# Altium schematic sheet 09.SchDoc
size 297 x 209 mm
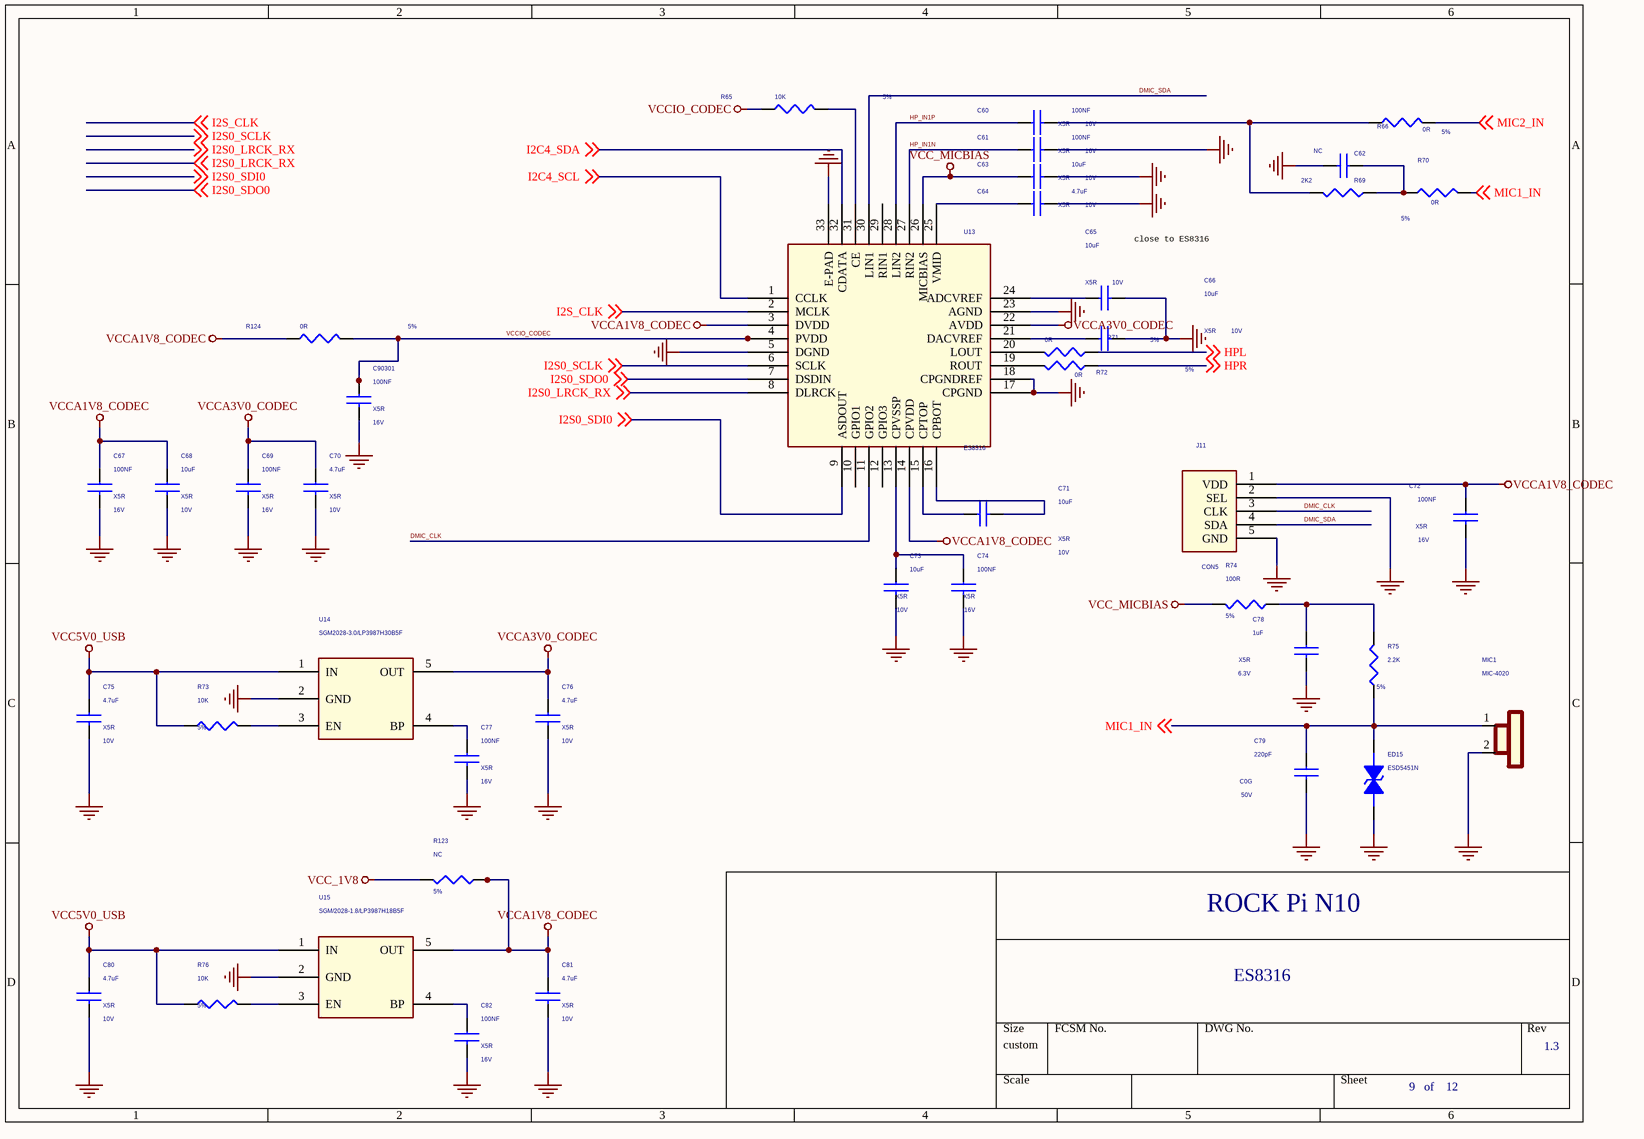
[diagram p0: 09.SchDoc]

## Parts
C60  100NF  Dielectric: X5R  Voltage: 16V  [C0402]
C61  100NF  Dielectric: X5R  Voltage: 16V  [C0402]
C62  NC  [C0402]
C63  10uF  Dielectric: X5R  Voltage: 10V  [C0603]
C64  4.7uF  Dielectric: X5R  Voltage: 10V  [C0402]
C65  10uF  Dielectric: X5R  Voltage: 10V  [C0603]
C66  10uF  Dielectric: X5R  Voltage: 10V  [C0603]
C67  100NF  Dielectric: X5R  Voltage: 16V  [C0402]
C68  10uF  Dielectric: X5R  Voltage: 10V  [C0603]
C69  100NF  Dielectric: X5R  Voltage: 16V  [C0402]
C70  4.7uF  Dielectric: X5R  Voltage: 10V  [C0402]
C71  10uF  Dielectric: X5R  Voltage: 10V  [C0603]
C72  100NF  Dielectric: X5R  Voltage: 16V  [C0402]
C73  10uF  Dielectric: X5R  Voltage: 10V  [C0603]
C74  100NF  Dielectric: X5R  Voltage: 16V  [C0402]
C75  4.7uF  Dielectric: X5R  Voltage: 10V  [C0603]
C76  4.7uF  Dielectric: X5R  Voltage: 10V  [C0603]
C77  100NF  Dielectric: X5R  Voltage: 16V  [C0402]
C78  1uF  Dielectric: X5R  Voltage: 6.3V  [C0402]
C79  220pF  Dielectric: C0G  Voltage: 50V  [C0402]
C80  4.7uF  Dielectric: X5R  Voltage: 10V  [C0603]
C81  4.7uF  Dielectric: X5R  Voltage: 10V  [C0603]
C82  100NF  Dielectric: X5R  Voltage: 16V  [C0402]
C90301  100NF  Dielectric: X5R  Voltage: 16V  [C0402]
ED15  ESD5451N  [ESD0402]
J11  CON5  [SDO-4030]
MIC1  MIC-4020  [CN1X2-1.25-SMT]
R65  10K  Tolerance: 5%  [R0402]
R66  0R  Tolerance: 5%  [R0402]
R69  2K2  [R0402]
R70  0R  Tolerance: 5%  [R0402]
R71  0R  Tolerance: 5%  [R0402]
R72  0R  Tolerance: 5%  [R0402]
R73  10K  Tolerance: 5%  [R0402]
R74  100R  Tolerance: 5%  [R0402]
R75  2.2K  Tolerance: 5%  [R0402]
R76  10K  Tolerance: 5%  [R0402]
R123  NC  Tolerance: 5%  [R0402]
R124  0R  Tolerance: 5%  [R0402]
U13  ES8316  [QFN32P4X4]
U14  SGM2028-3.0/LP3987H30B5F  [SOT_23_5]
U15  SGM/2028-1.8/LP3987H18B5F  [SOT_23_5]

## Nets
GND: C61.2 C62.2 C63.2 C64.2 C65.2 C66.2 C67.2 C68.2 C69.2 C70.2 C72.2 C73.2 C74.2 C75.2 C76.2 C77.2 C78.2 C79.2 C80.2 C81.2 C82.2 C90301.2 ED15.2 J11.2(SEL) J11.5(GND) MIC1.2 U13.5(DGND) U13.17(CPGND) U13.18(CPGNDREF) U13.23(AGND) U13.33(E-PAD) U14.2(GND) U15.2(GND)
VCC5V0_USB: C75.1 C80.1 R73.1 R76.1 U14.1(IN) U15.1(IN)
VCC_1V8: R123.1
VCC_MICBIAS: C63.1 R74.1 U13.26(MICBIAS)
VCCA1V8_CODEC: C67.1 C68.1 C72.1 C81.1 J11.1(VDD) R123.2 R124.1 U13.3(DVDD) U13.14(CPVDD) U15.5(OUT)
VCCA3V0_CODEC: C69.1 C70.1 C76.1 U13.22(AVDD) U14.5(OUT)
VCCIO_CODEC: C90301.1 R65.1 R124.2 U13.4(PVDD)
DMIC_CLK: J11.3(CLK) U13.11(GPIO2)
DMIC_SDA: J11.4(SDA) U13.30(LIN1)
HP_IN1N: C61.1 U13.27(RIN2)
HP_IN1P: C60.1 U13.28(LIN2)
HPL: R71.1 ; off-sheet HPL
HPR: R72.1 ; off-sheet HPR
I2C4_SCL: U13.1(CCLK) ; off-sheet I2C4_SCL
I2C4_SDA: U13.32(CDATA) ; off-sheet I2C4_SDA
I2S0_LRCK_RX: U13.8(DLRCK) ; off-sheet I2S0_LRCK_RX
I2S0_SCLK: U13.6(SCLK) ; off-sheet I2S0_SCLK
I2S0_SDI0: U13.9(ASDOUT) ; off-sheet I2S0_SDI0
I2S0_SDO0: U13.7(DSDIN) ; off-sheet I2S0_SDO0
I2S_CLK: U13.2(MCLK) ; off-sheet I2S_CLK
MIC1_IN: C79.1 ED15.1 MIC1.1 R70.2 R75.2 ; off-sheet MIC1_IN
MIC2_IN: R66.2 ; off-sheet MIC2_IN
NetC60_2: C60.2 R66.1 R69.1
NetC62_1: C62.1 R69.2 R70.1
NetC64_1: C64.1 U13.25(VMID)
NetC65_1: C65.1 U13.24(ADCVREF)
NetC66_1: C66.1 U13.21(DACVREF)
NetC71_1: C71.1 U13.15(CPTOP)
NetC71_2: C71.2 U13.16(CPBOT)
NetC73_1: C73.1 C74.1 U13.13(CPVSSP)
NetC77_1: C77.1 U14.4(BP)
NetC78_1: C78.1 R74.2 R75.1
NetC82_1: C82.1 U15.4(BP)
NetR65_2: R65.2 U13.31(CE)
NetR71_2: R71.2 U13.20(LOUT)
NetR72_2: R72.2 U13.19(ROUT)
NetR73_2: R73.2 U14.3(EN)
NetR76_2: R76.2 U15.3(EN)

Not connected (* = marked no-connect by the designer): U13 10(GPIO1) 12(GPIO3) 29(RIN1)

## Notes on the sheet
- close to ES8316
- ROCK Pi N10
- ES8316
- 1.3
- 9   of    12

## Library data of the parts
C60 C69 C74 C90301 = CAP NP_2: cap,100.00nF,+/-10%,16V,X5R,C0402; Manufacturer PN: C1005X5R1C104K050BA; Manufacturer: TDK; Tolerance: 10%; Priority: A; Created by: JJJ; Part Type: C0402; RK PN: C1005X5R1C104K050BA
C61 C67 C72 C77 C82 = CAP NP_2: cap,100.00nF,+/-10%,16V,X5R,C0402; Manufacturer: TDK; RK PN: C1005X5R1C104K050BA; Priority: A; Tolerance: 10%; Part Type: C0402; Manufacturer PN: C1005X5R1C104K050BA; Created by: JJJ
C62 = CAP: RoHS CHIP CAP 0.1uF +10/-10% X7R
C63 C71 = CAP NP_2: cap,10.00uF,+/-10%,10V,X5R,C0805; Manufacturer PN: C2012X5R1A106K125AB; Manufacturer: TDK; Tolerance: 10%; Priority: A; Created by: JJJ; Part Type: C0805; RK PN: C2012X5R1A106K125AB
C64 C76 C81 = CAP NP_2: cap,4.70uF,+/-10%,10V,X5R,C0603; Manufacturer PN: C1608X5R1A475K080AC; Manufacturer: TDK; Tolerance: 10%; Priority: A; Created by: JJJ; Part Type: C0603; RK PN: C1608X5R1A475K080AC
C65 C66 C68 C73 = CAP NP_2: cap,10.00uF,+/-10%,10V,X5R,C0805; Manufacturer: TDK; RK PN: C2012X5R1A106K125AB; Priority: A; Tolerance: 10%; Part Type: C0805; Manufacturer PN: C2012X5R1A106K125AB; Created by: JJJ
C70 C75 C80 = CAP NP_2: cap,4.70uF,+/-10%,10V,X5R,C0603; Manufacturer: TDK; RK PN: C1608X5R1A475K080AC; Priority: A; Tolerance: 10%; Part Type: C0603; Manufacturer PN: C1608X5R1A475K080AC; Created by: JJJ
C78 = CAP NP_2: cap,1.00uF,+/-10%,6.3V,X5R,C0402; Manufacturer: TDK; RK PN: C1005X5R0J105K050BB; Priority: A; Tolerance: 10%; Part Type: C0402; Manufacturer PN: C1005X5R0J105K050BB; Created by: JJJ
C79 = CAP NP_2: cap,220.00pF,+/-5%,50V,C0G,C0402; Manufacturer: TDK; RK PN: C1005C0G1H221J050BA; Priority: A; Tolerance: 5%; Part Type: C0402; Manufacturer PN: C1005C0G1H221J050BA; Created by: JJJ
ED15 = DIODE BI_DIR TRIG_0: 1-Line, Bi-directional, Transient Voltage Suppressors.17.5pF.; Manufacturer: WillSemi(韦尔半导体); Priority: A; Created by: JJJ; Manufacturer PN: ESD5451N; Part Type: ESD_TVS; RK PN: ESD5451N
J11 = CON5_0
MIC1 = MIC: mic 咪头; Manufacturer: 待更新; Priority: A; RK PN: MIC; Part Type: MIC; Manufacturer Part Number: MIC-4020; Created by: JJJ
R65 = RESISTOR_3: 通用厚膜电阻,10k,+/-5%,R0402,1/16W.; Manufacturer PN: RC0402JR-0733RL; Manufacturer: YAGEO; Wattage: 1/16W; Priority: A; Created by: YTL; Part Type: 通用厚膜电阻; RK PN: RC0402JR-0733RL
R66 R70 = RESISTOR_3: 通用厚膜电阻,22R,+/-5%,R0402,1/16W.; Manufacturer: YAGEO; RK PN: RC0402JR-0722RL; Priority: A; Wattage: 1/16W; Part Type: 通用厚膜电阻; Manufacturer PN: RC0402JR-0722RL; Created by: YTL
R69 = RESISTOR: ROHS CHIP RES 2K2 1/16W 5%
R71 R72 = RESISTOR_3: 通用厚膜电阻,22R,+/-5%,R0402,1/16W.; Manufacturer PN: RC0402JR-0722RL; Manufacturer: YAGEO; Wattage: 1/16W; Priority: A; Created by: YTL; Part Type: 通用厚膜电阻; RK PN: RC0402JR-0722RL
R73 R76 = RESISTOR_3: 通用厚膜电阻,10K,+/-5%,R0402,1/16W.; Manufacturer PN: RC0402JR-0710KL; Manufacturer: YAGEO; Wattage: 1/16W; Priority: A; Created by: YTL; Part Type: 通用厚膜电阻; RK PN: RC0402JR-0710KL
R74 R123 = RESISTOR_3: 通用厚膜电阻,100R,+/-5%,R0402,1/16W.; Manufacturer PN: RC0402JR-07100RL; Manufacturer: YAGEO; Wattage: 1/16W; Priority: A; Created by: YTL; Part Type: 通用厚膜电阻; RK PN: RC0402JR-07100RL
R75 = RESISTOR_3: 通用厚膜电阻,2K2,+/-5%,R0402,1/16W.; Manufacturer: YAGEO; RK PN: RC0402JR-072K2L; Priority: A; Wattage: 1/16W; Part Type: 通用厚膜电阻; Manufacturer PN: RC0402JR-072K2L; Created by: YTL
R124 = RESISTOR_3: 通用厚膜电阻,33R,+/-5%,R0402,1/16W.; Manufacturer: YAGEO; RK PN: RC0402JR-0733RL; Priority: A; Wattage: 1/16W; Part Type: 通用厚膜电阻; Manufacturer PN: RC0402JR-0733RL; Created by: YTL
U13 = CODEC_ES8316: Low Power Audio CODEC; Manufacturer: Everest（顺芯）; Priority: A; Created by: JJJ; Manufacturer PN: ES8316; Part Type: Codec; RK PN: ES8316
U14 U15 = LDO_PT5108: 500mA, Low Dropout, Low Noise Ultra-Fast Without Bypass Capacitor CMOS LDO Regulator; Manufacturer: Richtek（立錡）; Manufacturer PN: RT9013-30GB; Option: /CE75B30M; RK PN: RT9013-30B; Priority: A; Part Type: LDO; Created by: JJJ